# Altium schematic sheet Sheet2.SchDoc
size A3; SheetNumber: 2; SheetTotal: 2
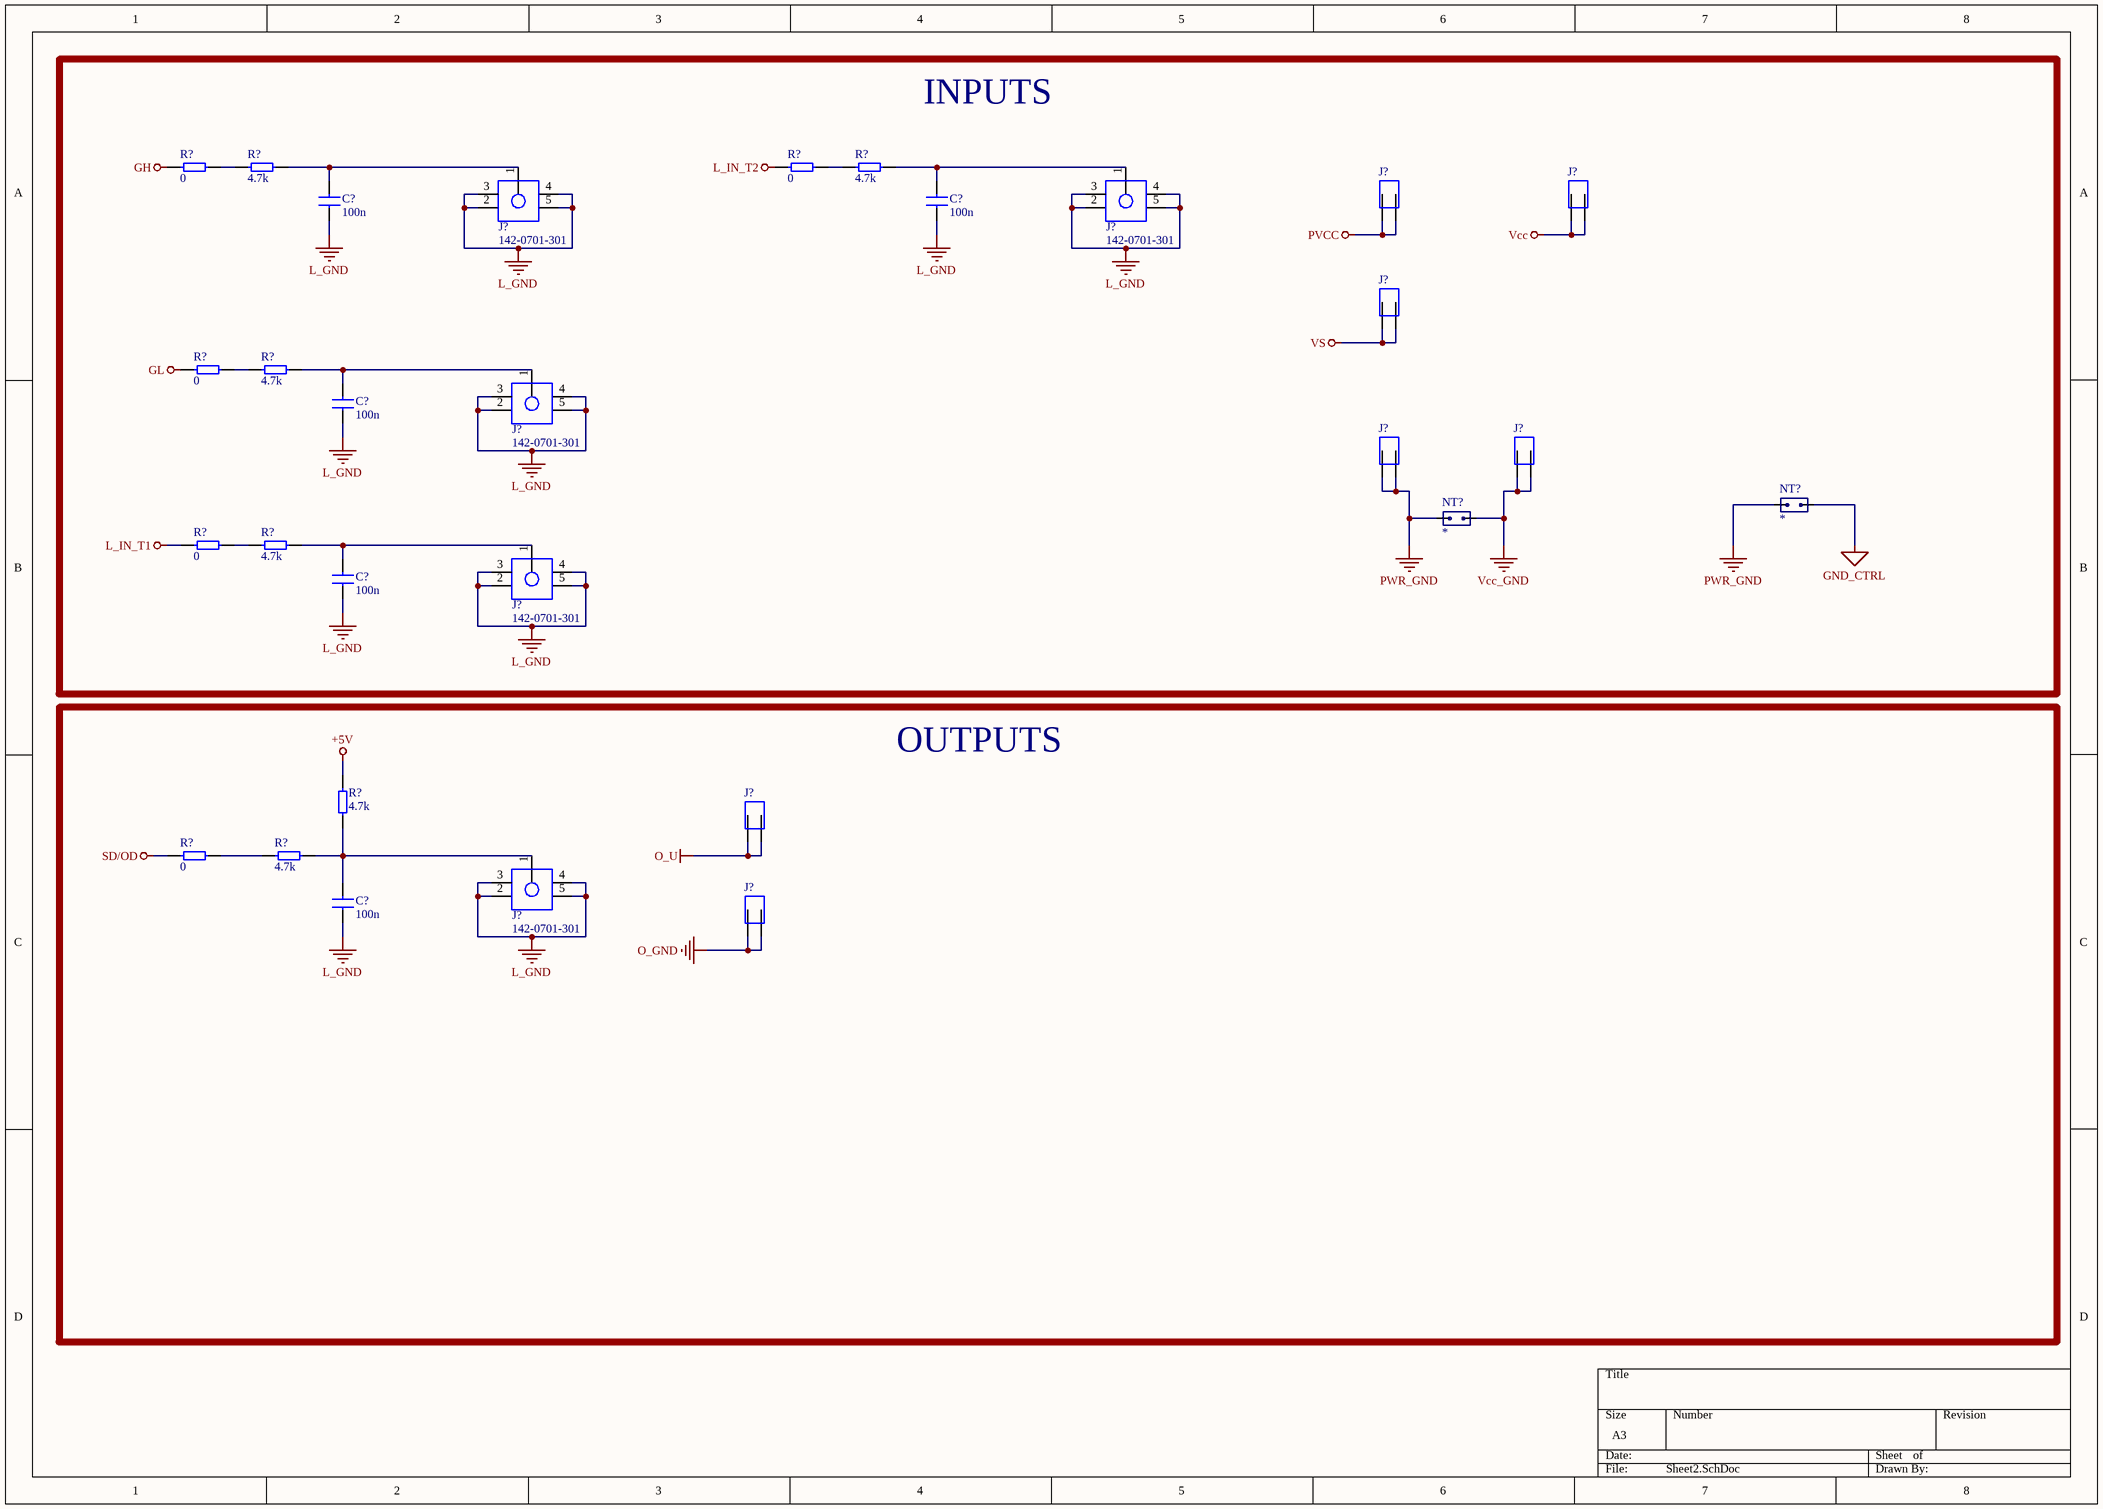
[diagram p0: Sheet2.SchDoc]

## Parts
(Parts that share a designator on the sheet are numbered #1, #2 ... from top to bottom, then left to right.)
C?#1  100n  [Capcitor_1206]
C?#2  100n  [Capcitor_1206]
C?#3  100n  [Capcitor_1206]
C?#4  100n  [Capcitor_1206]
C?#5  100n  [Capcitor_1206]
J?#1  142-0701-301  [1420701301]
J?#2  142-0701-301  [1420701301]
J?#3  1289-STR  [1289STR]  (value not drawn)
J?#4  1289-STR  [1289STR]  (value not drawn)
J?#5  1289-STR  [1289STR]  (value not drawn)
J?#6  142-0701-301  [1420701301]
J?#7  1289-STR  [1289STR]  (value not drawn)
J?#8  1289-STR  [1289STR]  (value not drawn)
J?#9  142-0701-301  [1420701301]
J?#10  1289-STR  [1289STR]  (value not drawn)
J?#11  142-0701-301  [1420701301]
J?#12  1289-STR  [1289STR]  (value not drawn)
NT?#1  *  [Net tie]  (net tie, no BOM)
NT?#2  *  [Net tie]  (net tie, no BOM)
R?#1  0  [Resistor_1206]
R?#2  4.7k  [Resistor_1206]
R?#3  0  [Resistor_1206]
R?#4  4.7k  [Resistor_1206]
R?#5  0  [Resistor_1206]
R?#6  4.7k  [Resistor_1206]
R?#7  0  [Resistor_1206]
R?#8  4.7k  [Resistor_1206]
R?#9  4.7k  [Resistor_1206]
R?#10  0  [Resistor_1206]
R?#11  4.7k  [Resistor_1206]

## Blocks framed on the sheet
INPUTS: C?#1-C?#4 J?#1-J?#9 NT?#1 NT?#2 R?#1-R?#8
OUTPUTS: C?#5 J?#10-J?#12 R?#9-R?#11

## Nets
+5V: R?#9.2
GH: R?#1.2
GL: R?#5.2
GND_CTRL: NT?#1.2
L_GND: C?#1.2 C?#2.2 C?#3.2 C?#4.2 C?#5.2 J?#1.2 J?#1.3 J?#1.4 J?#1.5 J?#2.2 J?#2.3 J?#2.4 J?#2.5 J?#6.2 J?#6.3 J?#6.4 J?#6.5 J?#9.2 J?#9.3 J?#9.4 J?#9.5 J?#11.2 J?#11.3 J?#11.4 J?#11.5
L_IN_T1: R?#7.2
L_IN_T2: R?#3.2
O_GND: J?#12.1 J?#12.2
O_U: J?#10.1 J?#10.2
PVCC: J?#3.1 J?#3.2
PWR_GND: J?#7.1 J?#7.2 NT?#1.1 NT?#2.1
SD/OD: R?#10.2
Vcc: J?#4.1 J?#4.2
Vcc_GND: J?#8.1 J?#8.2 NT?#2.2
VS: J?#5.1 J?#5.2
NetC?#1_1: C?#1.1 J?#1.1 R?#2.1
NetC?#2_1: C?#2.1 J?#2.1 R?#4.1
NetC?#3_1: C?#3.1 J?#6.1 R?#6.1
NetC?#4_1: C?#4.1 J?#9.1 R?#8.1
NetC?#5_1: C?#5.1 J?#11.1 R?#9.1 R?#11.1
NetR?#1_1: R?#1.1 R?#2.2
NetR?#3_1: R?#3.1 R?#4.2
NetR?#5_1: R?#5.1 R?#6.2
NetR?#7_1: R?#7.1 R?#8.2
NetR?#10_1: R?#10.1 R?#11.2

## Library data of the parts
C?#1-C?#5 = Capacitor_1206: Capacitor - Standard SMD; Voltage: 35 V; Capacitance: 100n; MPN: *
J?#1 J?#2 J?#6 J?#9 J?#11 = 142-0701-301: Connector; Manufacturer_Name: Cinch Connectivity Solutions; Datasheet Link: https://datasheet.datasheetarchive.com/originals/distributors/Datasheets_SAMA/2ec9b041f970d014d2778887508fd87c.pdf; Height: 9.779mm; Manufacturer_Part_Number: 142-0701-301; Mouser Part Number: 530-142-0701-301; Mouser Price/Stock: https://www.mouser.co.uk/ProductDetail/Johnson-Cinch-Connectivity-Solutions/142-0701-301?qs=VqHsQWpF6un5h9kBF%252BTxDw%3D%3D; Arrow Part Number: 142-0701-301; Arrow Price/Stock: https://www.arrow.com/en/products/142-0701-301/cinch-connectivity-solutions?region=nac
J?#3-J?#5 J?#7 J?#8 J?#10 J?#12 = 1289-STR: Connector; Manufacturer_Name: Keystone Electronics; Datasheet Link: https://www.mouser.com/datasheet/2/215/Keystone_Electronics_12182018_1289-ST-1510776.pdf; Height: 14.37mm; Manufacturer_Part_Number: 1289-STR; Mouser Part Number: 534-1289-STR; Mouser Price/Stock: https://www.mouser.co.uk/ProductDetail/Keystone-Electronics/1289-STR?qs=0lSvoLzn4L%252BMUIbPVNHg8g%3D%3D
NT?#1 NT?#2 = Net tie: Value: *; HelpURL: *; MPN: *
R?#1-R?#11 = Resistor_1206: Resistor - Standard SMD; Power rate: *; MPN: *
  R?#1 R?#3 R?#5 R?#7 R?#10: Resistance: 0
  R?#2 R?#4 R?#6 R?#8 R?#9 R?#11: Resistance: 4.7k